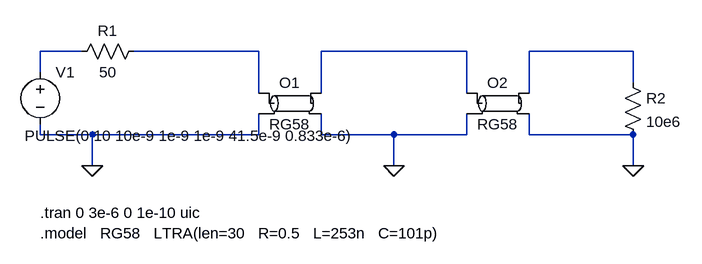
[diagram p0: schematic V5 Impulse auf Leitungen 1a.asc]
V5 Impulse auf Leitungen 1a.asc, the LTspice schematic file:
Version 4
SHEET 1 880 680
WIRE -528 -96 -592 -96
WIRE -256 -96 -448 -96
WIRE 64 -96 -160 -96
WIRE 320 -96 160 -96
WIRE -592 -64 -592 -96
WIRE 320 -48 320 -96
WIRE -256 -32 -256 -96
WIRE -160 -32 -160 -96
WIRE 64 -32 64 -96
WIRE 160 -32 160 -96
WIRE -592 32 -592 16
WIRE -512 32 -592 32
WIRE -256 32 -256 0
WIRE -256 32 -512 32
WIRE -160 32 -160 0
WIRE -48 32 -160 32
WIRE 64 32 64 0
WIRE 64 32 -48 32
WIRE 160 32 160 0
WIRE 320 32 160 32
WIRE -512 80 -512 32
WIRE -48 80 -48 32
WIRE 320 80 320 32
FLAG -512 80 0
FLAG -48 80 0
FLAG 320 80 0
SYMBOL voltage -592 -80 R0
WINDOW 123 0 0 Left 0
WINDOW 39 0 0 Left 0
WINDOW 3 -24 114 Left 2
SYMATTR InstName V1
SYMATTR Value PULSE(0 10 10e-9 1e-9 1e-9 41.5e-9 0.833e-6)
SYMBOL res -432 -112 R90
WINDOW 0 0 56 VBottom 2
WINDOW 3 32 56 VTop 2
SYMATTR InstName R1
SYMATTR Value 50
SYMBOL res 304 -64 R0
SYMATTR InstName R2
SYMATTR Value 10e6
SYMBOL ltline -208 -16 R0
SYMATTR InstName O1
SYMATTR Value RG58
SYMBOL ltline 112 -16 R0
SYMATTR InstName O2
SYMATTR Value RG58
TEXT -592 152 Left 2 !.tran 0 3e-6 0 1e-10 uic
TEXT -592 184 Left 2 !.model   RG58   LTRA(len=30   R=0.5   L=253n   C=101p)

The netlist it stands for:
* V5 Impulse auf Leitungen 1a.asc
V1 N001 0 PULSE(0 10 10e-9 1e-9 1e-9 41.5e-9 0.833e-6)
R1 N002 N001 50
R2 N004 0 10e6
O1 N002 0 N003 0 RG58
O2 N003 0 N004 0 RG58
.tran 0 3e-6 0 1e-10 uic
.model   RG58   LTRA(len=30   R=0.5   L=253n   C=101p)
.backanno
.end